# Altium schematic sheet Prescaler_HMC862A.SchDoc
size A4; SheetNumber: 17; SheetTotal: 26
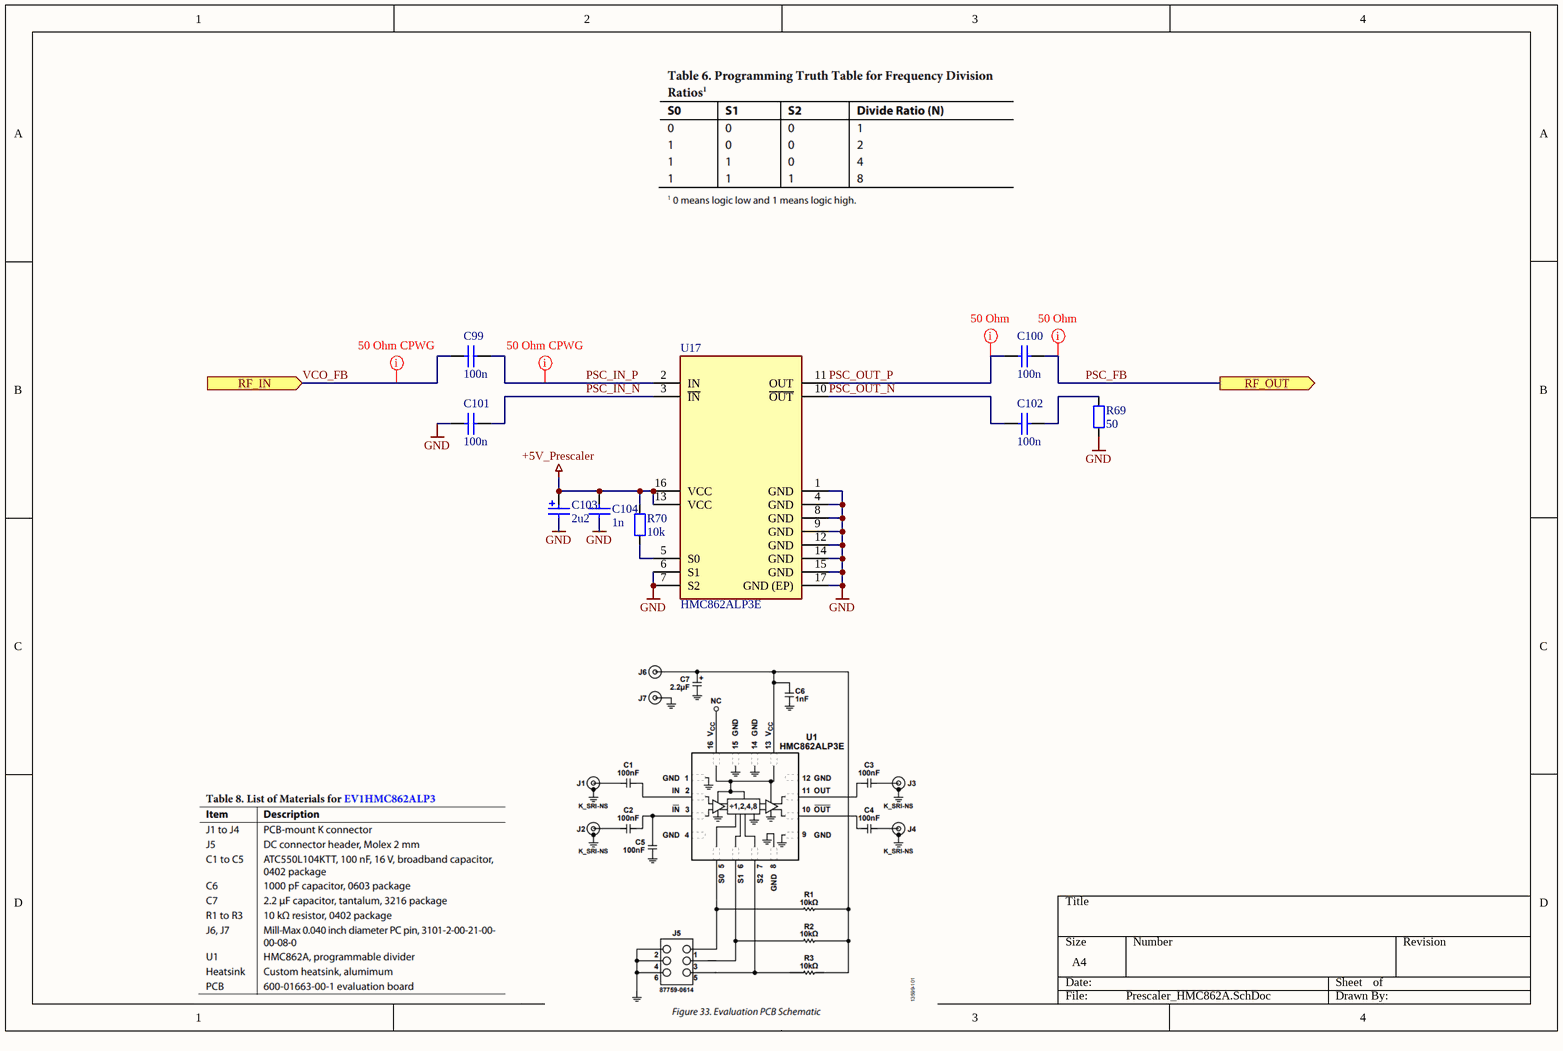
[diagram p0: Prescaler_HMC862A.SchDoc]

## Parts
C99  100n  [C_0402_1005Metric_IPC_N]
C100  100n  [C_0402_1005Metric_IPC_N]
C101  100n  [C_0402_1005Metric_IPC_N]
C102  100n  [C_0402_1005Metric_IPC_N]
C103  2u2  [C_1206_3216Metric_Pol_IPC_N]
C104  1n  [C_0603_1608Metric_IPC_N]
R69  50  [R_0402_1005Metric_IPC_N]
R70  10k  [R_0402_1005Metric_IPC_N]
U17  HMC862ALP3E  [LFCSP-16-1EP_3x3mm_P0.5mm_EP1.7x1.7mm_IPC_N]

## Ports
RF_IN (in, see Top_Level[3C]), RF_OUT (out, see Top_Level[2C])

## Nets
+5V_Prescaler: C103.1 C104.2 R70.1 U17.13(VCC) U17.16(VCC)
GND: C101.2 C103.2 C104.1 R69.1 U17.1(GND) U17.4(GND) U17.6(S1) U17.7(S2) U17.8(GND) U17.9(GND) U17.12(GND) U17.14(GND) U17.15(GND) U17.17(GND_(EP))
PSC_FB: C100.2 ; port RF_OUT
PSC_IN_N: C101.1 U17.3(~{IN})
PSC_IN_P: C99.1 U17.2(IN)
PSC_OUT_N: C102.1 U17.10(~{OUT})
PSC_OUT_P: C100.1 U17.11(OUT)
VCO_FB: C99.2 ; port RF_IN
NetC102_2: C102.2 R69.2
NetR70_2: R70.2 U17.5(S0)

## Layout directives
net class 50R: PSC_FB, PSC_OUT_P
net class 50Ohm_CPWG: PSC_IN_P, VCO_FB

## Library data of the parts
C99-C102 = C000002: Generic MLCC with 0402 Footprint; Specific Component: False; ID: C000002; Capacitance: 100n; Tolerance: *; Temp Coefficient: *; Voltage Rated: *; min Temperature: *; max Temperature: *; Case: 0402
C103 = C000008: Generic MLCC with 1206 Footprint; Specific Component: False; ID: C000008; Capacitance: 2u2; Tolerance: *; Temp Coefficient: *; Voltage Rated: *; min Temperature: *; max Temperature: *; Case: 1206
C104 = C000003: Generic MLCC with 0603 Footprint; Specific Component: False; ID: C000003; Capacitance: 1n; Tolerance: *; Temp Coefficient: *; Voltage Rated: *; min Temperature: *; max Temperature: *; Case: 0603
R69 R70 = R000002: Generic Chip Resistor with 0402 Footprint; Specific Component: False; ID: R000002; Tolerance: *; Power Rating: *; Composition: *; min Temperature: *; max Temperature: *; Temp Coefficient: *; Case: 0402
  R69: Resistance: 50
  R70: Resistance: 10k
U17 = RF000011: Prescaler 5V Divide By 1/2/4/8 24000MHz 16-Pin LFCSP EP Cut Tape; Manufacturer_Name: Analog Devices; Geometry.Height: 0.9mm; Mouser Part Number: 584-HMC862ALP3E; Mouser Price/Stock: https://www.mouser.co.uk/ProductDetail/Analog-Devices/HMC862ALP3E?qs=JeIcUl65ClBGwj3wYTXQsA%3D%3D; Manufacturer_Part_Number: HMC862ALP3E; Datasheet Link: https://www.mouser.jp/datasheet/2/609/hmc862a-1504252.pdf; ID: RF000011; Type: Prescaler; Manufacturer Part Number: HMC862ALP3E; Manufacturer: Analog Devices; Part Value: HMC862ALP3E; Case: 16-LFCSP (3x3); ComponentLink1Description: Datasheet; ComponentLink1URL: https://www.analog.com/media/en/technical-documentation/data-sheets/hmc862a.pdf; Supplier 1: Mouser; Supplier Part Number 1: 584-HMC862ALP3E; Supplier 2: Digikey; Supplier Part Number 2: 505-HMC862ALP3E-ND